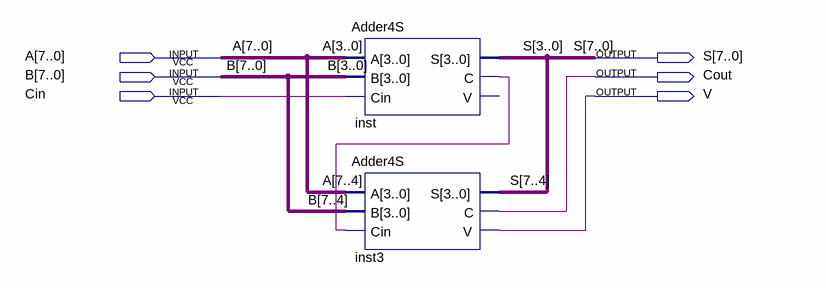
[diagram p0: schematic sheet]
// Quartus schematic Adder8.bdf as structural Verilog: 2 symbols, 6 pins
module Adder8 (
  input  [7:0] A,
  input  [7:0] B,
  input  Cin,
  output [7:0] S,
  output Cout,
  output V
);

  wire inst_c;

  Adder4S inst (.A(A[3:0]), .B(B[3:0]), .Cin(Cin), .S(S[3:0]), .C(inst_c));  // open: V
  Adder4S inst3 (.A(A[7:4]), .B(B[7:4]), .Cin(inst_c), .S(S[7:4]), .C(Cout), .V(V));
endmodule
